# Altium schematic sheet CH641P-R0-1v0.SchDoc
size 304 x 203 mm; SheetNumber: 0; SheetTotal: 0
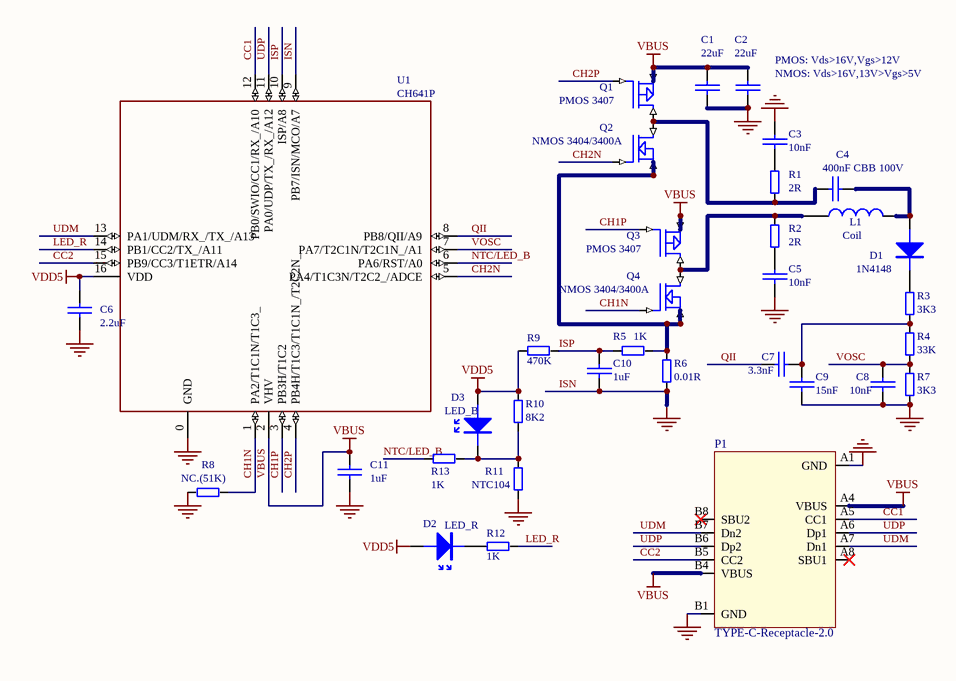
[diagram p0: CH641P-R0-1v0.SchDoc]

## Parts
C1  22uF  [1206_C]
C2  22uF  [1206_C]
C3  10nF  [0603_C]
C4  400nF CBB 100V  [SMD2-2.3x2.8_P7.8mm]
C5  10nF  [0603_C]
C6  2.2uF  [0603_C]
C7  3.3nF  [0603_C]
C8  10nF  [0603_C]
C9  15nF  [0603_C]
C10  1uF  [0603_C]
C11  1uF  [0603_C]
D1  1N4148  [1206+]
D2  LED_R  [0603+]
D3  LED_B  [0603+]
L1  Coil  [SMD2-4x2.5_P17mm]
P1  TYPE-C-Receptacle-2.0  [TYPE-C-Receptacle-2.0]
Q1  PMOS 3407  [SOT-23]
Q2  NMOS 3404/3400A  [SOT-23]
Q3  PMOS 3407  [SOT-23]
Q4  NMOS 3404/3400A  [SOT-23]
R1  2R  [0603]
R2  2R  [0603]
R3  3K3  [0603]
R4  33K  [0603]
R5  1K  [0603]
R6  0.01R  [1206]
R7  3K3  [0603]
R8  NC.(51K)  [0603]
R9  470K  [0603]
R10  8K2  [0603]
R11  NTC104  [0603]
R12  1K  [0603]
R13  1K  [0603]
U1  CH641P  [QFN16_3X3]

## Nets
ISN: C1.2 C2.2 C3.1 C5.2 C6.2 C8.2 C9.2 C10.2 C11.2 P1.A1(GND) P1.B1(GND) R6.1 R7.1 R8.2 R11.1 U1.0(GND) U1.9(PB7/ISN/MCO/A7)  [also labelled GND]
VBUS: C1.1 C2.1 C11.1 P1.A4(VBUS) P1.B4(VBUS) Q1.2(S) Q3.2(S) U1.2(VHV)
VDD5: C6.1 D2.1(A) D3.1(A) R9.1 R10.1 U1.16(VDD)
CC1: P1.A5(CC1) U1.12(PB0/SWIO/CC1/RX_/A10)
CC2: P1.B5(CC2) U1.15(PB9/CC3/T1ETR/A14)
CH1N: Q4.1(G) R8.1 U1.1(PA2/T1C1N/T1C3_)
CH1P: Q3.1(G) U1.3(PB3H/T1C2)
CH2N: Q2.1(G) U1.5(PA4/T1C3N/T2C2_/ADCE)
CH2P: Q1.1(G) U1.4(PB4H/T1C3/T1C1N_/T2C2N_)
ISP: C10.1 R5.1 R9.2 U1.10(ISP/A8)
LED_R: R12.2 U1.14(PB1/CC2/TX_/A11)
NTC/LED_B: R13.1 U1.6(PA6/RST/A0)
QII: C7.1 U1.8(PB8/QII/A9)
UDM: P1.A7(Dn1) P1.B7(Dn2) U1.13(PA1/UDM/RX_/TX_/A13)
UDP: P1.A6(Dp1) P1.B6(Dp2) U1.11(PA0/UDP/TX_/RX_/A12)
VOSC: C8.1 R4.1 R7.2 U1.7(PA7/T2C1N/T2C1N_/A1)
NetC3_2: C3.2 R1.2
NetC4_1: C4.1 Q1.3(D) Q2.3(D) R1.1
NetC4_2: C4.2 D1.1(A) L1.2
NetC5_1: C5.1 R2.1
NetC7_2: C7.2 C9.1 R3.1 R4.2
NetD1_2: D1.2(K) R3.2
NetD2_2: D2.2(K) R12.1
NetD3_2: D3.2(K) R10.2 R11.2 R13.2
NetL1_1: L1.1 Q3.3(D) Q4.3(D) R2.2
NetQ2_2: Q2.2(S) Q4.2(S) R5.2 R6.2

Not connected (* = marked no-connect by the designer): P1 A8(SBU1)* B8(SBU2)*

## Notes on the sheet
- (near C2) PMOS: Vds>16V,Vgs>12V
- (near C2) NMOS: Vds>16V,13V>Vgs>5V

## Library data of the parts
C1-C11 = CAP: Capacitor
D1 = DIODE
D2 D3 = LED
L1 = INDUCTOR
P1 = TYPE-C-Receptacle-2.0: Type-C USB2.0 母座
Q1 Q3 = PMOS: P-MOSFET
Q2 Q4 = NMOS: N-MOSFET
R1-R13 = R
U1 = CH641P: RISC-V MCU with PD/ADC/UART/OA, for wireless charging